# Altium schematic sheet 框图.SchDoc
size A3
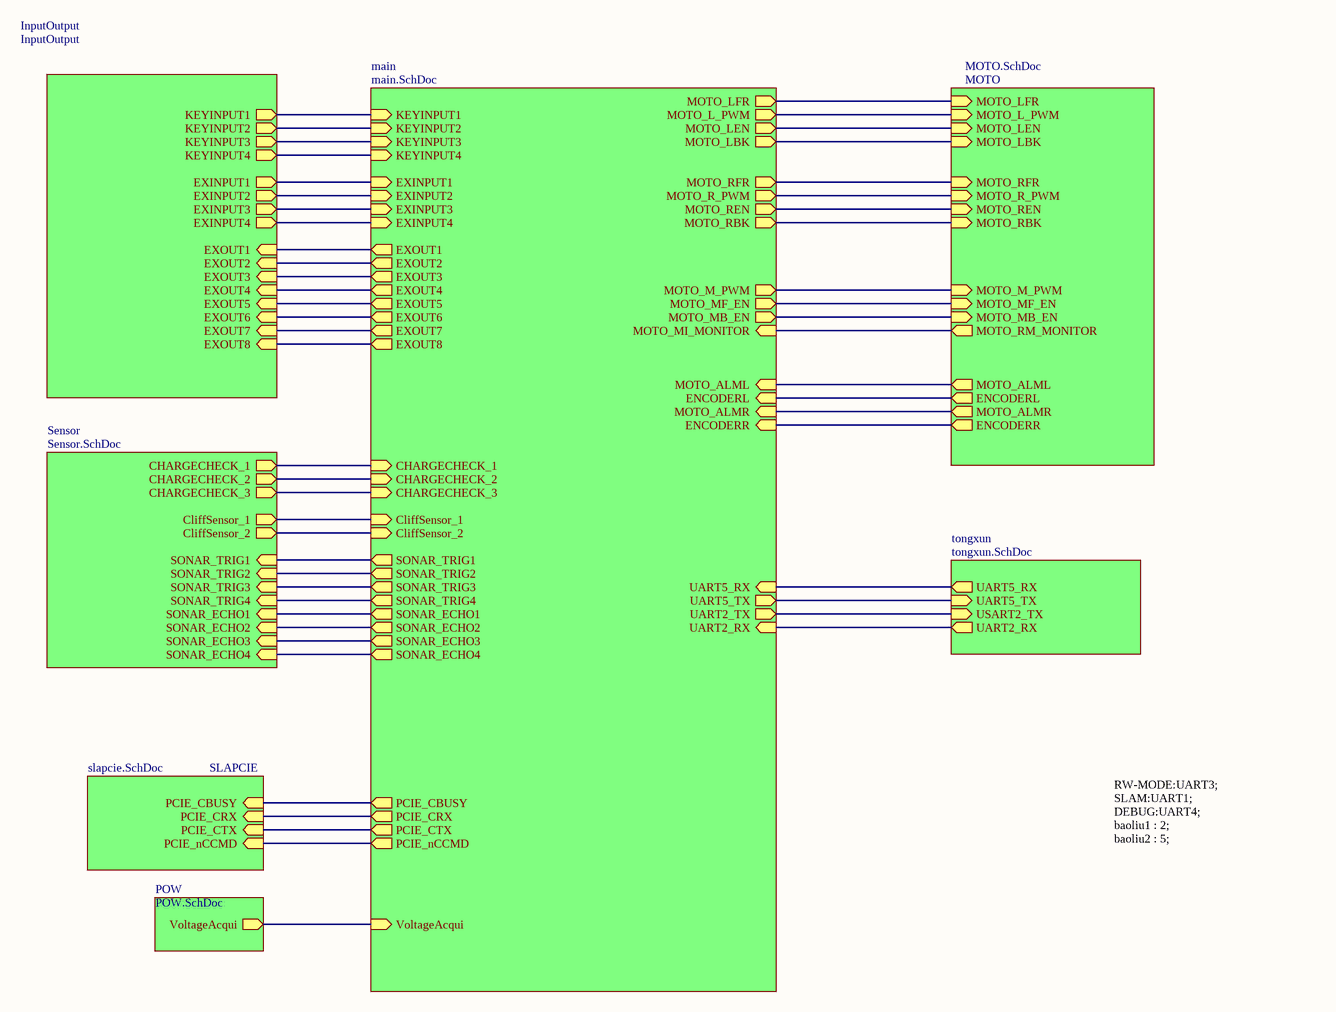
[diagram p0: 框图.SchDoc]

## Sub-sheets
InputOutput = InputOutput: KEYINPUT1 (out), KEYINPUT2 (out), KEYINPUT3 (out), KEYINPUT4 (out), EXINPUT1 (out), EXINPUT2 (out), EXINPUT3 (out), EXINPUT4 (out), EXOUT1 (in), EXOUT2 (in), EXOUT3 (in), EXOUT4 (in), EXOUT5 (in), EXOUT6 (in), EXOUT7 (in), EXOUT8 (in)
main = main.SchDoc: PCIE_CBUSY (out), PCIE_nCCMD (out), MOTO_MB_EN (out), MOTO_M_PWM (out), MOTO_MF_EN (out), MOTO_LEN (out), MOTO_REN (out), MOTO_RBK (out), MOTO_LBK (out), SONAR_ECHO1 (out), SONAR_ECHO2 (out), SONAR_ECHO3 (out), SONAR_ECHO4 (out), SONAR_TRIG1 (out), SONAR_TRIG2 (out), SONAR_TRIG3 (out), MOTO_R_PWM (out), MOTO_L_PWM (out), SONAR_TRIG4 (out), PCIE_CRX (out), PCIE_CTX (out), MOTO_MI_MONITOR (in), MOTO_ALML (in), ENCODERL (in), MOTO_ALMR (in), ENCODERR (in), MOTO_LFR (out), MOTO_RFR (out), CHARGECHECK_1 (in), CHARGECHECK_2 (in), CHARGECHECK_3 (in), CliffSensor_1 (in), CliffSensor_2 (in), KEYINPUT1 (in), KEYINPUT2 (in), KEYINPUT3 (in), KEYINPUT4 (in), EXINPUT1 (in), EXINPUT2 (in), EXINPUT3 (in), EXINPUT4 (in), EXOUT1 (out), EXOUT2 (out), EXOUT3 (out), EXOUT4 (out), EXOUT5 (out), EXOUT6 (out), EXOUT7 (out), EXOUT8 (out), VoltageAcqui (in), UART5_RX (in), UART5_TX (out), UART2_TX (out), UART2_RX (in)
MOTO = MOTO.SchDoc: MOTO_L_PWM (in), MOTO_LEN (in), MOTO_LBK (in), MOTO_R_PWM (in), MOTO_REN (in), MOTO_RBK (in), MOTO_MF_EN (in), MOTO_MB_EN (in), MOTO_RM_MONITOR (out), MOTO_ALML (out), ENCODERL (out), MOTO_ALMR (out), ENCODERR (out), MOTO_M_PWM (in), MOTO_LFR (in), MOTO_RFR (in)
POW = POW.SchDoc: VoltageAcqui (out)
Sensor = Sensor.SchDoc: CHARGECHECK_1 (out), CHARGECHECK_2 (out), CHARGECHECK_3 (out), CliffSensor_1 (out), CliffSensor_2 (out), SONAR_TRIG1 (in), SONAR_TRIG2 (in), SONAR_TRIG3 (in), SONAR_TRIG4 (in), SONAR_ECHO1 (in), SONAR_ECHO2 (in), SONAR_ECHO3 (in), SONAR_ECHO4 (in)
SLAPCIE = slapcie.SchDoc: PCIE_CBUSY (in), PCIE_CRX (in), PCIE_CTX (in), PCIE_nCCMD (in)
tongxun = tongxun.SchDoc: USART2_TX (in), UART2_RX (out), UART5_RX (out), UART5_TX (in)

## Nets
(unnamed): sheet main/PCIE_CBUSY, sheet SLAPCIE/PCIE_CBUSY
(unnamed): sheet main/PCIE_nCCMD, sheet SLAPCIE/PCIE_nCCMD
(unnamed): sheet main/MOTO_MB_EN, sheet MOTO/MOTO_MB_EN
(unnamed): sheet main/MOTO_M_PWM, sheet MOTO/MOTO_M_PWM
(unnamed): sheet main/MOTO_MF_EN, sheet MOTO/MOTO_MF_EN
(unnamed): sheet main/MOTO_LEN, sheet MOTO/MOTO_LEN
(unnamed): sheet main/MOTO_REN, sheet MOTO/MOTO_REN
(unnamed): sheet main/MOTO_RBK, sheet MOTO/MOTO_RBK
(unnamed): sheet main/MOTO_LBK, sheet MOTO/MOTO_LBK
(unnamed): sheet main/SONAR_ECHO1, sheet Sensor/SONAR_ECHO1
(unnamed): sheet main/SONAR_ECHO2, sheet Sensor/SONAR_ECHO2
(unnamed): sheet main/SONAR_ECHO3, sheet Sensor/SONAR_ECHO3
(unnamed): sheet main/SONAR_ECHO4, sheet Sensor/SONAR_ECHO4
(unnamed): sheet main/SONAR_TRIG1, sheet Sensor/SONAR_TRIG1
(unnamed): sheet main/SONAR_TRIG2, sheet Sensor/SONAR_TRIG2
(unnamed): sheet main/SONAR_TRIG3, sheet Sensor/SONAR_TRIG3
(unnamed): sheet main/MOTO_R_PWM, sheet MOTO/MOTO_R_PWM
(unnamed): sheet main/MOTO_L_PWM, sheet MOTO/MOTO_L_PWM
(unnamed): sheet main/SONAR_TRIG4, sheet Sensor/SONAR_TRIG4
(unnamed): sheet main/PCIE_CRX, sheet SLAPCIE/PCIE_CRX
(unnamed): sheet main/PCIE_CTX, sheet SLAPCIE/PCIE_CTX
(unnamed): sheet main/MOTO_MI_MONITOR, sheet MOTO/MOTO_RM_MONITOR
(unnamed): sheet main/MOTO_ALML, sheet MOTO/MOTO_ALML
(unnamed): sheet main/ENCODERL, sheet MOTO/ENCODERL
(unnamed): sheet main/MOTO_ALMR, sheet MOTO/MOTO_ALMR
(unnamed): sheet main/ENCODERR, sheet MOTO/ENCODERR
(unnamed): sheet main/MOTO_LFR, sheet MOTO/MOTO_LFR
(unnamed): sheet main/MOTO_RFR, sheet MOTO/MOTO_RFR
(unnamed): sheet main/CHARGECHECK_1, sheet Sensor/CHARGECHECK_1
(unnamed): sheet main/CHARGECHECK_2, sheet Sensor/CHARGECHECK_2
(unnamed): sheet main/CHARGECHECK_3, sheet Sensor/CHARGECHECK_3
(unnamed): sheet main/CliffSensor_1, sheet Sensor/CliffSensor_1
(unnamed): sheet main/CliffSensor_2, sheet Sensor/CliffSensor_2
(unnamed): sheet main/KEYINPUT1, sheet InputOutput/KEYINPUT1
(unnamed): sheet main/KEYINPUT2, sheet InputOutput/KEYINPUT2
(unnamed): sheet main/KEYINPUT3, sheet InputOutput/KEYINPUT3
(unnamed): sheet main/KEYINPUT4, sheet InputOutput/KEYINPUT4
(unnamed): sheet main/EXINPUT1, sheet InputOutput/EXINPUT1
(unnamed): sheet main/EXINPUT2, sheet InputOutput/EXINPUT2
(unnamed): sheet main/EXINPUT3, sheet InputOutput/EXINPUT3
(unnamed): sheet main/EXINPUT4, sheet InputOutput/EXINPUT4
(unnamed): sheet main/EXOUT1, sheet InputOutput/EXOUT1
(unnamed): sheet main/EXOUT2, sheet InputOutput/EXOUT2
(unnamed): sheet main/EXOUT3, sheet InputOutput/EXOUT3
(unnamed): sheet main/EXOUT4, sheet InputOutput/EXOUT4
(unnamed): sheet main/EXOUT5, sheet InputOutput/EXOUT5
(unnamed): sheet main/EXOUT6, sheet InputOutput/EXOUT6
(unnamed): sheet main/EXOUT7, sheet InputOutput/EXOUT7
(unnamed): sheet main/EXOUT8, sheet InputOutput/EXOUT8
(unnamed): sheet main/VoltageAcqui, sheet POW/VoltageAcqui
(unnamed): sheet main/UART5_RX, sheet tongxun/UART5_RX
(unnamed): sheet main/UART5_TX, sheet tongxun/UART5_TX
(unnamed): sheet main/UART2_TX, sheet tongxun/USART2_TX
(unnamed): sheet main/UART2_RX, sheet tongxun/UART2_RX

## Notes on the sheet
- RW-MODE:UART3;
  SLAM:UART1;
  DEBUG:UART4;
  baoliu1 : 2;
  baoliu2 : 5;